# EAGLE design wearable_sensor_v2(public) (EAGLE 8.4.1)
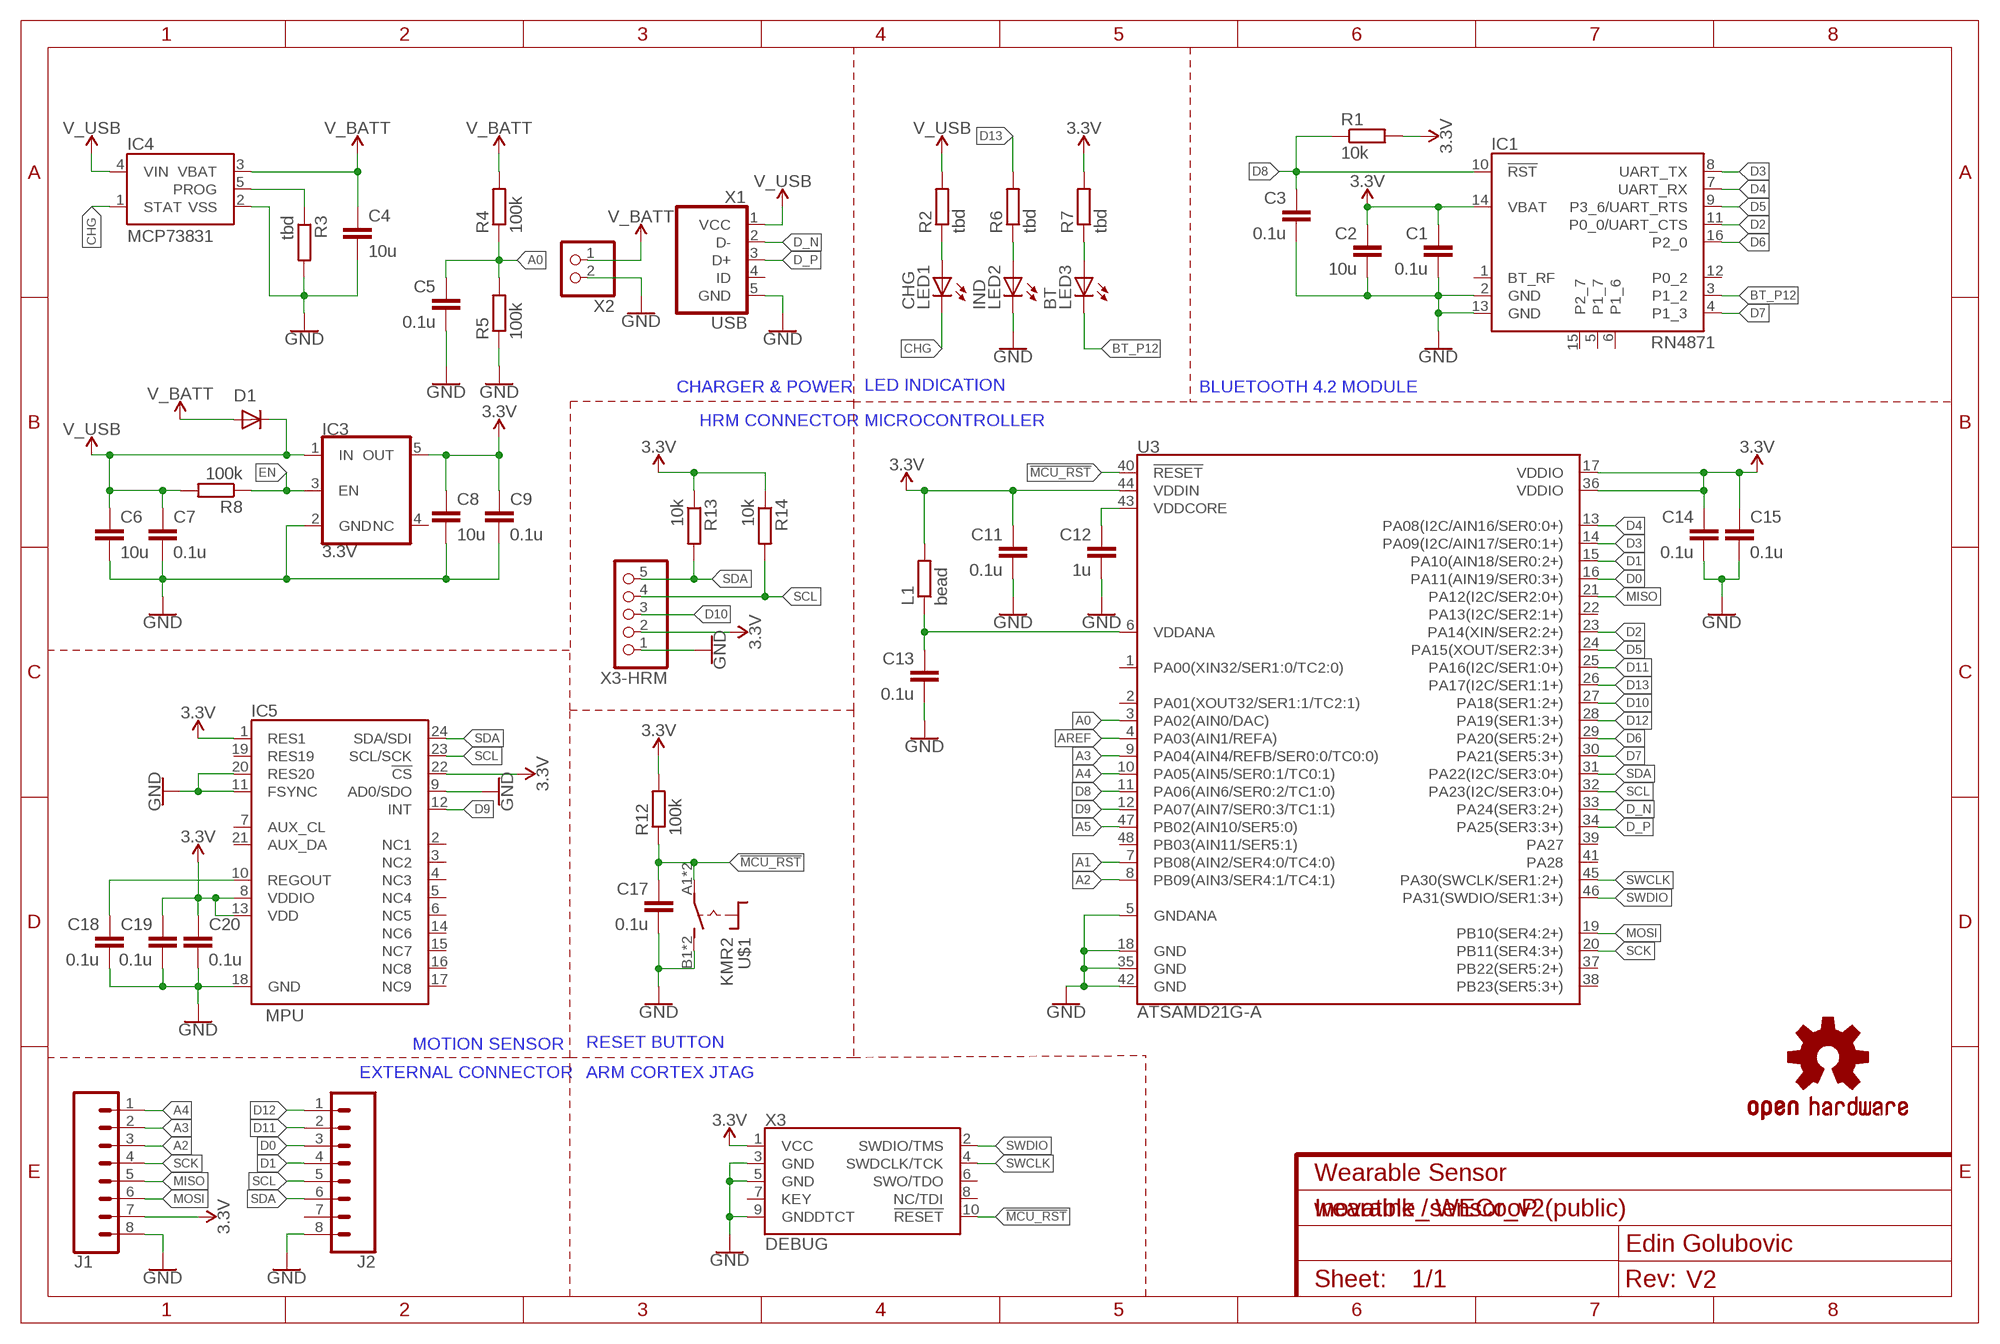
[diagram p0: schematic, sheet 1]
FRAME1 (FRAME-A4L): CNAME: Wearable Sensor; CREVISION: V2; DESIGNER: Edin Golubovic

## Parts
C1  0.1u  C-EUC0805  [C0805]
C2  10u  C-EUC0805  [C0805]
C3  0.1u  C-EUC0805  [C0805]
C4  10u  C-EUC0805  [C0805]
C5  0.1u  C-EUC0805  [C0805]
C6  10u  C-EUC0805  [C0805]
C7  0.1u  C-EUC0805  [C0805]
C8  10u  C-EUC0805  [C0805]
C9  0.1u  C-EUC0805  [C0805]
C11  0.1u  C-EUC0805  [C0805]
C12  1u  C-EUC0805  [C0805]
C13  0.1u  C-EUC0805  [C0805]
C14  0.1u  C-EUC0805  [C0805]
C15  0.1u  C-EUC0805  [C0805]
C17  0.1u  C-EUC0805  [C0805]
C18  0.1u  C-EUC0805  [C0805]
C19  0.1u  C-EUC0805  [C0805]
C20  0.1u  C-EUC0805  [C0805]
D1  DIODESOD-323F  [SOD-323F]
IC1  RN4871  [RN4871]
IC3  3.3V  V_REG_AP2112K-3.3V  [SOT23-5]
IC4  MCP73831  [SOT23-5]
IC5  MPU  MPU-9250  [MPU9250]
J1  CONN_08SMD-MALE  [1X08_SMD_MALE]
J2  CONN_08SMD-MALE  [1X08_SMD_MALE]
L1  bead  R-EU_R0805  [R0805]
LED1  CHG  LEDCHIP-LED0805  [CHIP-LED0805]
LED2  IND  LEDCHIP-LED0805  [CHIP-LED0805]
LED3  BT  LEDCHIP-LED0805  [CHIP-LED0805]
LOGO1  OSHW-LOGOMINI  [OSHW-LOGO-MINI]
R1  10k  R-EU_R0805  [R0805]
R2  tbd  R-EU_R0805  [R0805]
R3  tbd  R-EU_R0805  [R0805]
R4  100k  R-EU_R0805  [R0805]
R5  100k  R-EU_R0805  [R0805]
R6  tbd  R-EU_R0805  [R0805]
R7  tbd  R-EU_R0805  [R0805]
R8  100k  R-EU_R0805  [R0805]
R12  100k  R-EU_R0805  [R0805]
R13  10k  R-EU_R0805  [R0805]
R14  10k  R-EU_R0805  [R0805]
U3  ATSAMD21G-A  [TQFP-48]
U$1  KMR2  [KMR2]
X1  USB  10118194-0001LF  [10118194-0001LF]
X2  JST_2PIN-SMT-RA  [JST-PH-2-SMT-RA]
X3  DEBUG  CORTEX_DEBUG_PTH  [2X5-PTH-1.27MM]
X3-HRM  PINHD-1X5  [1X05]

## Nets
3.3V: C1.1 C2.1 C8.1 C9.1 C11.1 C14.1 C15.1 C19.1 C20.1 IC1.14(VBAT) IC3.5(OUT) IC5.1(RES1) IC5.8(VDDIO) IC5.13(VDD) IC5.22(!CS) J1.7 L1.2 R1.2 R7.2 R12.2 R13.1 R14.1 U3.17(VDDIO) U3.36(VDDIO) U3.44(VDDIN) X3-HRM.2 X3.1(VCC)
!MCU_RST: C17.1 R12.1 U3.40(!RESET!) U$1.A1(P) U$1.A2(P) X3.10(!RESET)
A0: C5.1 R4.1 R5.2 U3.3(PA02(AIN0/DAC))
A1: U3.7(PB08(AIN2/SER4:0/TC4:0))
A2: J1.3 U3.8(PB09(AIN3/SER4:1/TC4:1))
A3: J1.2 U3.9(PA04(AIN4/REFB/SER0:0/TC0:0))
A4: J1.1 U3.10(PA05(AIN5/SER0:1/TC0:1))
A5: U3.47(PB02(AIN10/SER5:0))
AREF: U3.4(PA03(AIN1/REFA))
BT_P12: IC1.3(P1_2) LED3.C
CHG: IC4.1(STAT) LED1.C
D0: J2.3 U3.16(PA11(AIN19/SER0:3+))
D1: J2.4 U3.15(PA10(AIN18/SER0:2+))
D2: IC1.11(P0_0/UART_CTS) U3.23(PA14(XIN/SER2:2+))
D3: IC1.8(UART_TX) U3.14(PA09(I2C/AIN17/SER0:1+))
D4: IC1.7(UART_RX) U3.13(PA08(I2C/AIN16/SER0:0+))
D5: IC1.9(P3_6/UART_RTS) U3.24(PA15(XOUT/SER2:3+))
D6: IC1.16(P2_0) U3.29(PA20(SER5:2+))
D7: IC1.4(P1_3) U3.30(PA21(SER5:3+))
D8: C3.1 IC1.10(!RST) R1.1 U3.11(PA06(AIN6/SER0:2/TC1:0))
D9: IC5.12(INT) U3.12(PA07(AIN7/SER0:3/TC1:1))
D10: U3.27(PA18(SER1:2+)) X3-HRM.3
D11: J2.2 U3.25(PA16(I2C/SER1:0+))
D12: J2.1 U3.28(PA19(SER1:3+))
D13: R6.2 U3.26(PA17(I2C/SER1:1+))
D_N: U3.33(PA24(SER3:2+)) X1.2(D-)
D_P: U3.34(PA25(SER3:3+)) X1.3(D+)
EN: IC3.3(EN) R8.1
GND: C1.2 C2.2 C3.2 C4.2 C5.2 C6.2 C7.2 C8.2 C9.2 C11.2 C12.2 C13.2 C14.2 C15.2 C17.2 C18.2 C19.2 C20.2 IC1.2(GND) IC1.13(GND) IC3.2(GND) IC4.2(VSS) IC5.9(AD0/SDO) IC5.11(FSYNC) IC5.18(GND) IC5.20(RES20) J1.8 J2.8 LED2.C R3.2 R5.1 U3.5(GNDANA) U3.18(GND) U3.35(GND) U3.42(GND) U$1.B1(S) U$1.B2(S) X1.5(GND) X2.2 X3-HRM.1 X3.3(GND) X3.5(GND) X3.9(GNDDTCT)
MISO: J1.5 U3.21(PA12(I2C/SER2:0+))
MOSI: J1.6 U3.19(PB10(SER4:2+))
N$1: LED2.A R6.1
N$2: LED1.A R2.1
N$3: IC4.5(PROG) R3.1
N$4: LED3.A R7.1
N$5: C18.1 IC5.10(REGOUT)
N$6: C13.1 L1.1 U3.6(VDDANA)
N$7: C12.1 U3.43(VDDCORE)
SCK: J1.4 U3.20(PB11(SER4:3+))
SCL: IC5.23(SCL/SCK) J2.5 R14.2 U3.32(PA23(I2C/SER3:0+)) X3-HRM.4
SDA: IC5.24(SDA/SDI) J2.6 R13.2 U3.31(PA22(I2C/SER3:0+)) X3-HRM.5
SWCLK: U3.45(PA30(SWCLK/SER1:2+)) X3.4(SWDCLK/TCK)
SWDIO: U3.46(PA31(SWDIO/SER1:3+)) X3.2(SWDIO/TMS)
V_BATT: C4.1 D1.A IC4.3(VBAT) R4.2 X2.1
V_USB: C6.1 C7.1 D1.C IC3.1(IN) IC4.4(VIN) R2.2 R8.2 X1.1(VCC)
Unconnected: IC1.1(BT_RF) IC1.5(P1_7) IC1.6(P1_6) IC1.12(P0_2) IC1.15(P2_7) IC3.4(NC) IC5.2(NC1) IC5.3(NC2) IC5.4(NC3) IC5.5(NC4) IC5.6(NC5) IC5.7(AUX_CL) IC5.14(NC6) IC5.15(NC7) IC5.16(NC8) IC5.17(NC9) IC5.19(RES19) IC5.21(AUX_DA) J2.7 U3.1(PA00(XIN32/SER1:0/TC2:0)) U3.2(PA01(XOUT32/SER1:1/TC2:1)) U3.22(PA13(I2C/SER2:1+)) U3.37(PB22(SER5:2+)) U3.38(PB23(SER5:3+)) U3.39(PA27) U3.41(PA28) U3.48(PB03(AIN11/SER5:1)) X1.4(ID) X3.6(SWO/TDO) X3.7(KEY) X3.8(NC/TDI)

## Notes on the sheet
- CHARGER & POWER | LED INDICATION | BLUETOOTH 4.2 MODULE
- HRM CONNECTOR | MICROCONTROLLER
- MOTION SENSOR | RESET BUTTON
- EXTERNAL CONNECTOR | ARM CORTEX JTAG
- Inovatink / WECooP

## Library data of the parts
C1-C9 C11-C15 C17-C20 = rcl:C-EU: CAPACITOR, European symbol
D1 = adafruit:DIODE: Diode SMADIODE - SMA Surface Mount Package 20V 1A Schottky Diode Digikey: 641-1014-6-ND DO-1N4148 - Through Hole Small Current Diode SOD-123 20V 1 A (.5mV Vf) Schottky Diode - Digikey: MBRX120TPMSCT-ND SOD-323 10V 570mA (.38mV Vf, 3ns) Schottky Diode - Digikey: ZLLS410CT-ND SOD-523 30V 30mA Schottky Diode (RB751S-40TE61) - Digikey: RB751S-40TE61CT-ND SOT23-R/W - SOT23 Package (R = Solder Paste/Reflow Ovens, W = Hand-Soldering) BAT54Film 40V 300mA - Digikey: 497-7162-1-ND
IC1 = private:RN4871
IC3 = SparkFun-IC-Power:V_REG_AP2112: AP2112 - 600mA CMOS LDO Regulator w/ Enable The AP2112 is CMOS process low dropout linear regulator with enable function, the regulator delivers a guaranteed 600mA (min.) continuous load current. Features Output Voltage Accuracy: ±1.5% Output Current: 600mA (Min.) Foldback Short Current Protection: 50mA Enable Function to Turn ON/OFF VOUT Low Dropout Voltage (3.3V): 250mV (Typ.) @IOUT=600mA Excellent Load Regulation: 0.2%/A (Typ.) Excellent Line Regulation: 0.02%/V (Typ.) Low Quiescent Current: 55μA (Typ.) Low Standby Current: 0.01μA (Typ.) Low Output Noise: 50μVRMS PSRR: 100Hz -65dB, 1kHz -65dB OTSD Protection Stable with 1.0μF Flexible Cap: Ceramic, Tantalum and Aluminum Electrolytic Operation Temperature Range: -40°C to 85°C ESD: MM 400V, HBM 4000V; PROD_ID: VREG-12457
IC4 = SparkFun-IC-Power:MCP73831: MCP73831T Li-Ion, Li-Pol Controller Miniature single cell, fully integrated Li-Ion, Li-polymer charge management controller Datasheet <http://ww1.microchip.com/downloads/en/DeviceDoc/20001984g.pdf> SparkFun Products: SparkFun ESP32 Thing <https://www.sparkfun.com/products/13907> SparkFun 9DoF Razor IMU M0 <https://www.sparkfun.com/products/14001>; PROD_ID: IC-09995
IC5 = private:MPU-9250: MPU-9250 is a 9-axis MotionTracking device that combines a 3-axis gyroscope, 3-axis accelerometer, 3-axis magnetometer and a Digital Motion Processor™ (DMP)
J1 J2 = SparkFun-Connectors:CONN_08: Multi connection point. Often used as Generic Header-pin footprint for 0.1 inch spaced/style header connections On any of the 0.1 inch spaced packages, you can populate with these: Break Away Headers - Straight <https://www.sparkfun.com/products/116> (PRT-00116) Break Away Male Headers - Right Angle <https://www.sparkfun.com/products/553> (PRT-00553) Female Headers <https://www.sparkfun.com/products/115> (PRT-00115) Break Away Headers - Machine Pin <https://www.sparkfun.com/products/117> (PRT-00117) Break Away Female Headers - Swiss Machine Pin <https://www.sparkfun.com/products/743> (PRT-00743) Arduino Stackable Header - 8 Pin <https://www.sparkfun.com/products/9279> (PRT-09279) For SCREWTERMINALS and SPRING TERMINALS visit here: Screw Terimnals on SparkFun.com <https://www.sparkfun.com/search/results?term=Screw+Terminals> (5mm/3.5mm/2.54mm spacing) This device is also useful as a general connection point to wire up your design to another part of your project. Our various solder wires solder well into these plated through hole pads. Hook-Up Wire - Assortment (Stranded, 22 AWG) <https://www.sparkfun.com/products/11375> (PRT-11375) Hook-Up Wire - Assortment (Solid Core, 22 AWG) <https://www.sparkfun.com/products/11367> (PRT-11367) View the entire wire category on our website here <https://www.sparkfun.com/categories/141> Special notes: Molex polarized connector foot print use with SKU : PRT-08231 with associated crimp pins and housings. 1MM SMD Version SKU: PRT-10208 NOTES ON THE VARIANTS LOCK and LOCK_LONGPADS... This footprint was designed to help hold the alignment of a through-hole component (i.e. 6-pin header) while soldering it into place. You may notice that each hole has been shifted either up or down by 0.005 of an inch from it's more standard position (which is a perfectly straight line). This slight alteration caused the pins (the squares in the middle) to touch the edges of the holes. Because they are alternating, it causes a "brace" to hold the component in place. 0.005 has proven to be the perfect amount of "off-center" position when using our standard breakaway headers. Although looks a little odd when you look at the bare footprint, once you have a header in there, the alteration is very hard to notice. Also,if you push a header all the way into place, it is covered up entirely on the bottom side.; PROD_ID: CONN-11292; SF_ID: PRT-11541
L1 R1-R8 R12-R14 = rcl:R-EU_: RESISTOR, European symbol
LED1-LED3 = led:LED: LED OSRAM: - CHIPLED LG R971, LG N971, LY N971, LG Q971, LY Q971, LO R971, LY R971 LH N974, LH R974 LS Q976, LO Q976, LY Q976 LO Q996 - Hyper CHIPLED LW Q18S LB Q993, LB Q99A, LB R99A - SideLED LS A670, LO A670, LY A670, LG A670, LP A670 LB A673, LV A673, LT A673, LW A673 LH A674 LY A675 LS A676, LA A676, LO A676, LY A676, LW A676 LS A679, LY A679, LG A679 - Hyper Micro SIDELED® LS Y876, LA Y876, LO Y876, LY Y876 LT Y87S - SmartLED LW L88C, LW L88S LB L89C, LB L89S, LG L890 LS L89K, LO L89K, LY L89K LS L896, LA L896, LO L896, LY L896 - TOPLED LS T670, LO T670, LY T670, LG T670, LP T670 LSG T670, LSP T670, LSY T670, LOP T670, LYG T670 LG T671, LOG T671, LSG T671 LB T673, LV T673, LT T673, LW T673 LH T674 LS T676, LA T676, LO T676, LY T676, LB T676, LH T676, LSB T676, LW T676 LB T67C, LV T67C, LT T67C, LS T67K, LO T67K, LY T67K, LW E67C LS E67B, LA E67B, LO E67B, LY E67B, LB E67C, LV E67C, LT E67C LW T67C LS T679, LY T679, LG T679 LS T770, LO T770, LY T770, LG T770, LP T770 LB T773, LV T773, LT T773, LW T773 LH T774 LS E675, LA E675, LY E675, LS T675 LS T776, LA T776, LO T776, LY T776, LB T776 LHGB T686 LT T68C, LB T68C - Hyper Mini TOPLED® LB M676 - Mini TOPLED Santana® LG M470 LS M47K, LO M47K, LY M47K Source: http://www.osram.convergy.de LUXEON: - LUMILED® LXK2-PW12-R00, LXK2-PW12-S00, LXK2-PW14-U00, LXK2-PW14-V00 LXK2-PM12-R00, LXK2-PM12-S00, LXK2-PM14-U00 LXK2-PE12-Q00, LXK2-PE12-R00, LXK2-PE12-S00, LXK2-PE14-T00, LXK2-PE14-U00 LXK2-PB12-K00, LXK2-PB12-L00, LXK2-PB12-M00, LXK2-PB14-N00, LXK2-PB14-P00, LXK2-PB14-Q00 LXK2-PR12-L00, LXK2-PR12-M00, LXK2-PR14-Q00, LXK2-PR14-R00 LXK2-PD12-Q00, LXK2-PD12-R00, LXK2-PD12-S00 LXK2-PH12-R00, LXK2-PH12-S00 LXK2-PL12-P00, LXK2-PL12-Q00, LXK2-PL12-R00 Source: www.luxeon.com KINGBRIGHT: KA-3528ASYC Source: www.kingbright.com
LOGO1 = SparkFun-Aesthetics:OSHW-LOGO: Open-Source Hardware (OSHW) Logo This logo indicates the piece of hardware it is found on incorporates a OSHW license and/or adheres to the definition of open source hardware found here: http://freedomdefined.org/OSHW
U3 = SparkFun-IC-Microcontroller:ATSAMD21G: Atmel SAMD21G SMART ARM-Based Microcontroller The Atmel ® | SMART ™ SAM D21 is a series of low-power microcontrollers using the 32-bit ARM ® Cortex ® -M0+ processor, and ranging from 32- to 64-pins with up to 256KB Flash and 32KB of SRAM. The SAM D21 devices operate at a maximum frequency of 48MHz and reach 2.46 CoreMark/MHz. They are designed for simple and intuitive migration with identical peripheral modules, hex compatible code, identical linear address map and pin compatible migration paths between all devices in the product series. All devices include intelligent and flexible peripherals, Atmel Event System for inter-peripheral signaling, and support for capacitive touch button, slider and wheel user interfaces. Datasheet <https://cdn.sparkfun.com/datasheets/Dev/Arduino/Boards/Atmel-42181-SAM-D21_Datasheet.pdf> SparkFun Products SparkFun SAMD21 Mini Breakout <https://www.sparkfun.com/products/13664> (DEV-13664) SparkFun SAMD21 Dev Breakout <https://www.sparkfun.com/products/13672> (DEV-13672); PROD_ID: IC-13064
U$1 = private:KMR2
X1 = con-fci:10118194-0001LF
X2 = adafruit:JST_2PIN: JST 2-Pin Connectors of various flavors SMT-RA (S2B-PH-SM4) 4UConnector #17311 SMT (B2B-PH-SM4) THM-RA (S2B-PH) THM (B2B-PH)
X3 = SparkFun-Connectors:CORTEX_DEBUG: Cortex Debug Connector - 10 pin Supports JTAG debug, Serial Wire debug, and Serial Wire Viewer. PTH and SMD connector options available. General Connector Information <http://infocenter.arm.com/help/topic/com.arm.doc.faqs/attached/13634/cortex_debug_connectors.pdf> Products: PTH Connector <http://www.digikey.com/product-detail/en/cnc-tech/3220-10-0100-00/1175-1627-ND/3883661> -via Digi-Key SparkFun PSoc <https://www.sparkfun.com/products/13229> SparkFun T <https://www.sparkfun.com/products/13810>
X3-HRM = pinhead:PINHD-1X5: PIN HEADER

## Board
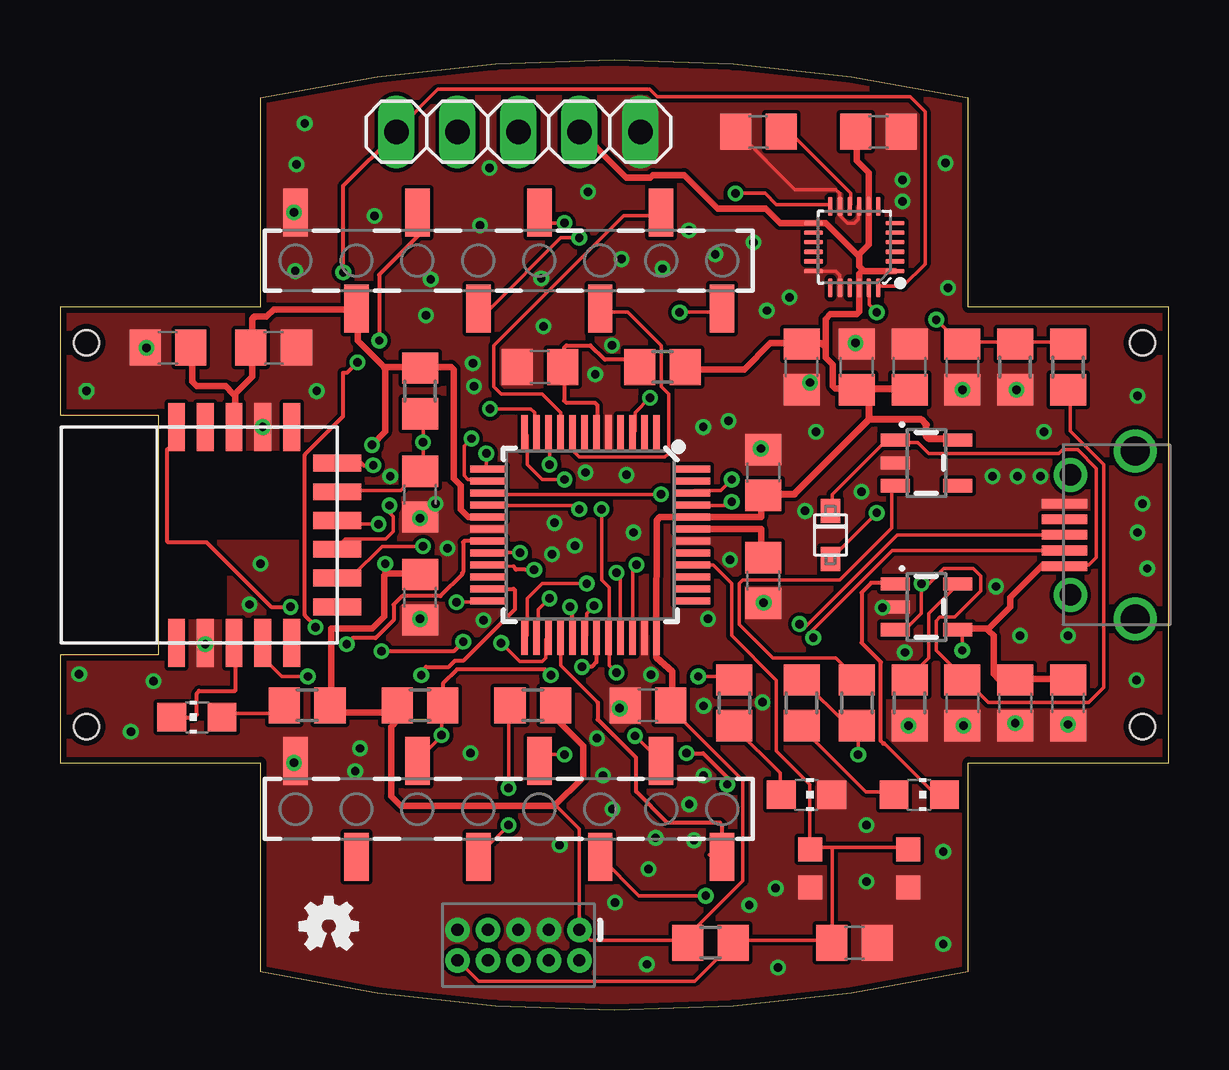
[diagram p1: board, top side]
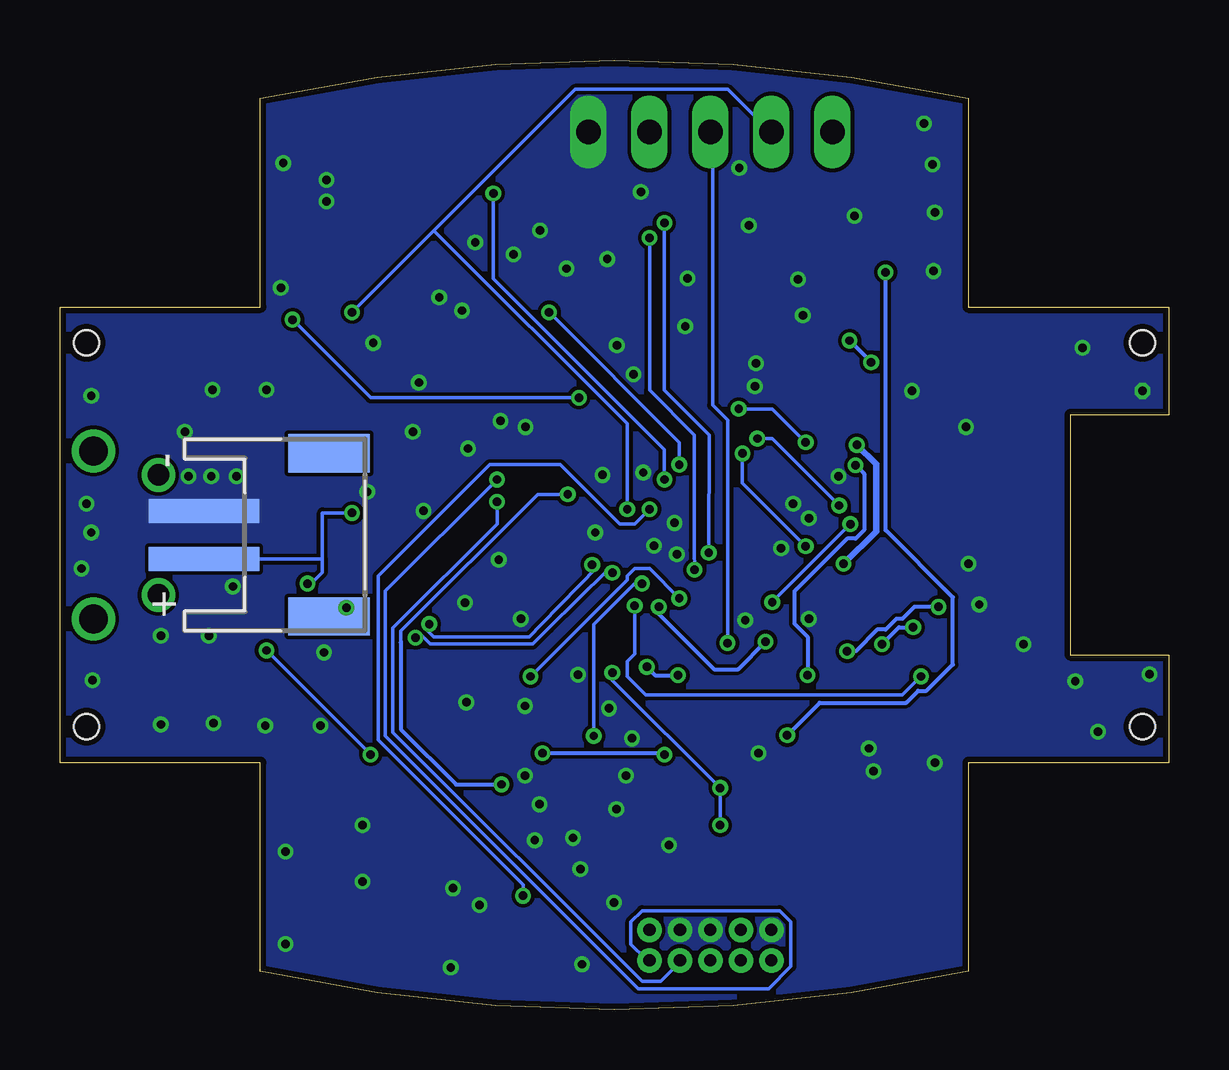
[diagram p2: board, bottom side, seen from below]

Size 46.2 x 39.6 mm. Coordinates in mm from the lower left corner, seen from the top.
Outline: 8.35,1.6 arc25 37.85,1.6 37.85,10.3 46.2,10.3 46.2,29.3 37.85,29.3 37.85,38 arc25 8.35,38 8.35,29.3 0,29.3 0,24.8 4.1,24.8 4.1,14.8 0,14.8 0,10.3 8.35,10.3 8.35,1.6
Copper layers (1*16): Top 0.035mm / dielectric 1.5mm / Bottom 0.035mm
Design rules "SeeedStudio_2layer_DRU_no_angle_20140221": minimum track width 6mil, minimum drill 12mil, track to track 6mil, track to pad 6mil, pad to pad 6mil, via to via 6mil, smd to smd 0mil, copper to edge 10mil, drill to drill 10mil, minimum pad ring 10mil, minimum via ring 6mil, stop-mask expansion 2mil, vias tented up to drill 100mil, thermal gap 10mil
Holes 1.05 mm at 1.1,27.8 1.1,11.8 45.1,27.8 45.1,11.8

### Footprints (pad centres in the part's own frame; a part is rotated, then mirrored left to right if it is on the bottom)
C0805 = smd 1.3 x 1.5: 1 -0.95,0; 2 0.95,0
SOD-323F = smd 1 x 0.8: A -1,0; C 1,0
RN4871 = smd 2 x 0.7: 1 -4.5,0.95; 2 -4.5,-0.25; 3 -4.5,-1.45; 4 -4.5,-2.65; 5 -4.5,-3.85; 12 4.5,-3.85; 13 4.5,-2.65; 14 4.5,-1.45; 15 4.5,-0.25; 16 4.5,0.95 | smd 0.7 x 2: 6 -3,-5.75; 7 -1.8,-5.75; 8 -0.6,-5.75; 9 0.6,-5.75; 10 1.8,-5.75; 11 3,-5.75
SOT23-5 = smd 0.55 x 1.2: 1 -0.95,-1.3; 2 0,-1.3; 3 0.95,-1.3; 4 0.95,1.3; 5 -0.95,1.3
MPU9250 = smd 0.8 x 0.2: 1 -1.7,1; 2 -1.7,0.6; 3 -1.7,0.2; 4 -1.7,-0.2; 5 -1.7,-0.6; 6 -1.7,-1; 13 1.7,-1; 14 1.7,-0.6; 15 1.7,-0.2; 16 1.7,0.2; 17 1.7,0.6; 18 1.7,1 | smd 0.2 x 0.8: 7 -1,-1.7; 8 -0.6,-1.7; 9 -0.2,-1.7; 10 0.2,-1.7; 11 0.6,-1.7; 12 1,-1.7; 19 1,1.7; 20 0.6,1.7; 21 0.2,1.7; 22 -0.2,1.7; 23 -0.6,1.7; 24 -1,1.7
1X08_SMD_MALE = smd 1.02 x 2: 1 -8.89,2; 2 -6.35,-2; 3 -3.81,2; 4 -1.27,-2; 5 1.27,2; 6 3.81,-2; 7 6.35,2; 8 8.89,-2
R0805 = smd 1.3 x 1.5: 1 -0.95,0; 2 0.95,0
CHIP-LED0805 = smd 1.2 x 1.2: A 0,-1.05; C 0,1.05
TQFP-48 = smd 1.5 x 0.28: 1 -4.25,2.75; 2 -4.25,2.25; 3 -4.25,1.75; 4 -4.25,1.25; 5 -4.25,0.75; 6 -4.25,0.25; 7 -4.25,-0.25; 8 -4.25,-0.75; 9 -4.25,-1.25; 10 -4.25,-1.75; 11 -4.25,-2.25; 12 -4.25,-2.75; 25 4.25,-2.75; 26 4.25,-2.25; 27 4.25,-1.75; 28 4.25,-1.25; 29 4.25,-0.75; 30 4.25,-0.25; 31 4.25,0.25; 32 4.25,0.75; 33 4.25,1.25; 34 4.25,1.75; 35 4.25,2.25; 36 4.25,2.75 | smd 0.28 x 1.5: 13 -2.75,-4.25; 14 -2.25,-4.25; 15 -1.75,-4.25; 16 -1.25,-4.25; 17 -0.75,-4.25; 18 -0.25,-4.25; 19 0.25,-4.25; 20 0.75,-4.25; 21 1.25,-4.25; 22 1.75,-4.25; 23 2.25,-4.25; 24 2.75,-4.25; 37 2.75,4.25; 38 2.25,4.25; 39 1.75,4.25; 40 1.25,4.25; 41 0.75,4.25; 42 0.25,4.25; 43 -0.25,4.25; 44 -0.75,4.25; 45 -1.25,4.25; 46 -1.75,4.25; 47 -2.25,4.25; 48 -2.75,4.25
KMR2 = smd 1 x 1: A1 -2.05,0.8; A2 2.05,0.8; B1 -2.05,-0.8; B2 2.05,-0.8
10118194-0001LF = smd 0.4 x 1.9: 1 -1.3,2.95; 2 -0.65,2.95; 3 0,2.95; 4 0.65,2.95; 5 1.3,2.95 | drill 0.9 pad 1.3: P$6 2.5,2.7; P$7 -2.5,2.7 | drill 1.2 pad 1.6: P$8 3.5,0; P$9 -3.5,0
JST-PH-2-SMT-RA = smd 1 x 4.6: 1 1,-3.7; 2 -1,-3.7 | smd 1.6 x 3.4: NC1 -3.4,1.5; NC2 3.4,1.5
2X5-PTH-1.27MM = drill 0.508 pad 1: 1 -2.54,-0.635; 2 -2.54,0.635; 3 -1.27,-0.635; 4 -1.27,0.635; 5 0,-0.635; 6 0,0.635; 7 1.27,-0.635; 8 1.27,0.635; 9 2.54,-0.635; 10 2.54,0.635
1X05 = drill 1.016 long: 1 -5.08,0; 2 -2.54,0; 3 0,0; 4 2.54,0; 5 5.08,0

### Placement (x,y rotation side)
C1  4.5,27.6 180 top
C2  8.9,27.6 0 top
C3  15,21.5 270 top
C4  37.6,12.8 270 top
C5  37.6,26.8 270 top
C6  42,12.8 270 top
C7  39.8,12.8 270 top
C8  35.4,26.8 90 top
C9  33.2,26.8 90 top
C11  29.3,22.4 90 top
C12  29.3,17.9 270 top
C13  20,26.8 180 top
C14  24.5,12.7 180 top
C15  15,17.2 270 top
C17  33.1,2.8 0 top
C18  29.1,36.6 180 top
C19  34.1,36.6 0 top
C20  30.9,26.8 270 top
D1  32.1,19.8 90 top
IC1  5.8,19.8 90 top
IC3  36.1,22.8 270 top
IC4  36.1,16.8 270 top
IC5  33.1,31.8 180 top
J1  18.7,31.23 180 top
J2  18.7,8.37 180 top
L1  25.1,26.8 0 top
LED1  35.8,8.97 270 top
LED2  31.1,8.97 270 top
LED3  5.7,12.2 90 top
LOGO1  11.2,3.5 0 top
R1  15,25.8 90 top
R2  30.9,12.8 90 top
R3  35.4,12.8 270 top
R4  42,26.8 270 top
R5  39.8,26.8 90 top
R6  28.1,12.8 90 top
R7  10.3,12.7 0 top
R8  33.2,12.8 270 top
R12  27.1,2.8 180 top
R13  15,12.7 0 top
R14  19.7,12.7 180 top
U3  22.1,19.8 270 top
U$1  33.3,5.9 0 top
X1  44.8,19.8 90 top
X2  36.5,19.8 270 bottom
X3  19.1,2.7 180 top
X3-HRM  19.1,36.6 180 top

### Tracks (layer width: path | path; a pad name or v marks a point on that pad's centre or on a via)
3.3V  (via drill 0.35)
  Top 0.155: 20.6,8.5 20.71,8.48 21.64,7.55 21.64,3.36 X3.1 21.79,3.21 22.1,2.9 26.13,2.9 R12.2 26.29,2.9 26.29,3.21 28.45,5.38 28.45,9.56 25.51,12.5 C14.1
  Top 0.28: C11.1 29.2,21.4 29.21,20.55 U3.44 24.99,20.55 24.86,20.41 24.85,15.64 U3.36 24.85,14.7 25.5,14.1 25.5,12.7 C14.1 25.5,12.6 | R14.1 20.7,12.7 20.7,12.1 21.8,11 21.8,9.7 20.6,8.5 14.2,8.5 13.8,8.9 13.8,11.8 14.1,12.1 14.1,12.7 R13.1 | R13.1 14,12.4 11.3,12.4 11.3,12.7 R7.2 11.3,12.8 11.3,15.9 13,15.9 13.5,16.4 13.5,18.1 13.6,18.2 | 14.1,12.8 R13.1 | 15.1,18.2 C15.1 14.9,18.2 13.6,18.2 | 31.9,27.6 31.7,27.8 30.9,27.8 C20.1 30.8,27.8 29.6,27.8 28.5,26.7 26.1,26.7 26,26.8 L1.2 | 31.9,27.6 31.9,27.2 32.2,26.9 32.2,26 32.3,25.9 33.1,25.9 C9.1 | 7.3,25.7 8,26.4 8,27.6 C2.1 8,27.7 8,28.8 8.1,28.9 8.6,28.9 8.9,29.2 12.3,29.2 J1.7 12.4,29.1 12.4,27.9 13.5,26.8 | 7.3,25.7 7.3,24.3 IC1.14 | C1.1 5.5,27.6 5.5,26.2 5.7,26 6.9,26 7.2,25.7 7.3,25.7 | 13.5,26.8 15,26.8 R1.2 15.1,26.8 16.3,26.8 16.4,26.7 16.4,22.15 16.7,21.85 16.7,20.85 17,20.55 U3.17 | X3-HRM.2 21.7,36.6 23.6,34.7 24.6,34.7 24.7,34.8 26,34.8 27.4,33.4 29.4,33.4 30,32.8 IC5.13 31.9,32.8 33.2,31.5 33.3,31.5 | IC5.1 33.4,30.8 | 33.4,30.8 33.3,30.7 IC5.22 33.3,29.1 33.2,29 32.1,29 31.9,28.8 31.9,27.6 | 33.3,31.5 33.7,31.9 IC5.8 33.7,34.9 33.2,35.4 33.2,36.6 C19.1 | 33.3,31.5 33.3,31 33.4,30.9 33.4,30.8 | v13,23.55 13.55,24.1 13.55,26.7 13.5,26.8 | v13.55,18.6 13.55,18.3 13.6,18.2
  Top 0.3: 33.7,24.6 30.6,21.5 29.3,21.5 C11.1 | 33.7,24.6 35.9,24.6 36.1,24.4 36.1,23.9 36.2,23.8 37.4,23.8 IC3.5 | 33.7,24.6 33.7,25.9 33.2,25.9 C9.1 33.8,25.9 35.4,25.9 C8.1
  Bottom 0.28: v13,23.55 12.2,22.75 12.2,19.95 v13.55,18.6
!MCU_RST
  Top 0.155: X3.10 16.68,1.97 17.45,1.19 26.44,1.19 27.99,2.74 R12.1 28.14,2.9 32.02,2.9 C17.1 32.17,2.9 32.17,6.77 | 32.17,6.77 35.27,6.77 U$1.A2 | 32.17,6.77 31.4,6.77 U$1.A1 31.24,6.77 31.24,9.41 29.85,10.8 29.85,13.74 27.99,15.6 27.99,17.77 27.21,18.55 26.44,18.55 U3.40
A0  (via drill 0.35)
  Top 0.155: R4.1 41.93,27.84 39.92,27.84 R5.2 39.77,27.84 37.75,27.84 C5.1 37.6,27.69 v36.51,28.77 | v24.58,25.52 23.96,24.9 23.96,24.13 U3.3
  Bottom 0.155: v24.58,25.52 33.26,25.52 v36.51,28.77
A2
  Top 0.155: U3.8 21.33,23.97 21.33,23.35 21.64,23.04 25.2,23.04 25.36,23.2 25.36,25.67 25.05,25.98 25.05,27.69 23.65,29.08 22.57,29.08 J1.3
A3
  Top 0.155: U3.9 20.86,24.13 20.86,24.9 20.09,25.67 18.38,25.67 18.07,25.98 18.07,27.69 23.5,33.11 25.05,33.11 J1.2
A4  (via drill 0.35)
  Top 0.155: v20.4,22.73 20.4,23.97 U3.10 | v25.82,29.08 27.52,29.08 J1.1
  Bottom 0.155: v20.4,22.73 20.4,23.66 v25.82,29.08
BT_P12
  Top 0.155: 7.23,14.67 7.23,15.29 IC1.3
  Top 0.16: IC1.3 7.3,14.7 7.3,13.3 5.8,13.3 5.7,13.2 5.7,12.3 5.6,12.2 LED3.C
CHG
  Top 0.155: 34.34,17.62 34.65,17.62 IC4.1 | 34.34,11.11 36.36,9.1 36.82,9.1 LED1.C
  Top 0.16: IC4.1 34.7,17.8 33.8,17.8 33.4,17.4 33.4,15.3 34.2,14.5 34.2,11.2 34.3,11.1 34.34,11.11
D0  (via drill 0.35)
  Top 0.155: v21.64,20.87 21.48,21.03 17.92,21.03 U3.16 | v26.91,4.76 24.12,4.76 22.57,6.31 J2.3
  Bottom 0.155: v21.64,20.87 22.26,20.25 22.88,20.25 25.36,22.73 28.3,22.73 32.95,18.08 32.95,11.27 26.91,5.22 v26.91,4.76
D1  (via drill 0.35)
  Top 0.155: v25.05,21.49 17.92,21.49 U3.15 | v21.02,10.65 20.24,10.65 20.09,10.49 J2.4
  Top 0.16: v26.1,10.7 26.8,10.7 27.8,9.7 v27.8,9.4 27.8,9.3
  Bottom 0.155: v25.05,21.49 26.29,21.49 32,15.8 32,15.34 32,15.3
  Bottom 0.16: v26.1,10.7 21.1,10.7 v21.02,10.65 | v27.8,9.4 29.7,9.4 32,11.7 32,15.3 32,15.34
D2  (via drill 0.35)
  Top 0.16: 15.05,14.1 v15.05,13.95 15.1,14.15 15.25,14.3 16.2,14.3 16.45,14.55 16.8,14.55 18.95,16.7 18.95,17.5 18.9,17.55 U3.23 | v13.05,22.7 12.65,22.7 12.55,22.8 IC1.11
  Bottom 0.16: v15.05,13.95 15.05,15.55 15.6,16.1 15.6,17.45 13.4,19.65 13.05,19.65 12.7,20 12.7,22.35 v13.05,22.7
D3  (via drill 0.35)
  Top 0.155: v17.14,23.82 16.83,23.51 16.83,22.27 16.99,22.11 17.76,22.11 U3.14 | v13.73,21.03 13.73,20.72 13.89,20.56 13.89,19.94 13.58,19.63 11.88,19.63 11.57,19.32 IC1.8
  Bottom 0.155: v17.14,23.82 16.52,23.82 v13.73,21.03
D4  (via drill 0.35)
  Top 0.155: v17.76,23.2 17.76,22.58 U3.13 | v15.13,19.32 13.42,19.32 12.19,18.08 11.57,18.08 IC1.7
  Bottom 0.155: v17.76,23.2 17.76,21.96 v15.13,19.32
D5  (via drill 0.35)
  Top 0.155: v16.52,17 17.76,17 U3.24 | v13.27,20.25 11.57,20.25 IC1.9
  Bottom 0.155: v13.27,20.25 v16.52,17
D6  (via drill 0.35)
  Top 0.16: v9.6,16.8 8.8,16.8 6.1,19.5 4.5,19.5 4.45,19.55 4.45,23.35 4.5,23.4 4.8,23.4 4.85,23.45 IC1.16 | v13.4,14.95 16.4,14.95 v16.8,15.35 | v21.25,16.8 21.25,16.7 21.35,16.6 U3.29
  Bottom 0.16: v13.4,14.95 13.05,14.95 12.15,15.85 11.8,15.85 11.35,16.3 11.1,16.3 10.6,16.8 v9.6,16.8 | v16.8,15.35 17.95,14.2 18.95,14.2 21.25,16.5 v21.25,16.8
D7  (via drill 0.35)
  Top 0.155: v22.26,16.84 21.95,16.53 21.95,15.6 U3.30 | v10.33,13.9 9.24,13.9 8.47,14.67 8.47,15.29 IC1.4
  Bottom 0.155: v22.26,16.84 22.26,14.83 22.57,14.52 22.57,13.9 21.79,13.12 11.1,13.12 v10.33,13.9
D8  (via drill 0.35)
  Top 0.155: R1.1 15.13,24.74 v15.13,23.66 15.13,22.58 C3.1 14.97,22.42 14.2,21.65 11.57,21.65 IC1.10 | v17.92,25.05 19.62,25.05 19.78,24.9 19.78,24.13 U3.11
  Bottom 0.155: v17.92,25.05 16.52,25.05 v15.13,23.66
D9  (via drill 0.35)
  Top 0.155: v28.14,34.04 29.38,34.04 29.85,33.58 32.02,33.58 IC5.12 | v21.02,22.11 20.09,22.11 19.47,22.73 19.47,23.97 U3.12
  Bottom 0.155: v28.14,34.04 28.14,30.48 21.02,23.35 v21.02,22.11
D10  (via drill 0.35)
  Top 0.155: v18.38,15.29 19.16,14.52 20.09,14.52 20.24,14.67 20.24,15.45 U3.27
  Bottom 0.155: v18.38,15.29 18.38,24.59 19,25.21 19,36.52 X3-HRM.3
D11  (via drill 0.35)
  Top 0.155: v21.95,17.77 20.09,17.77 19.47,17.15 19.47,15.6 U3.25 | v23.96,11.42 25.05,10.34 J2.2
  Bottom 0.155: v21.95,17.77 22.26,17.77 23.96,16.07 v23.96,11.42
D12
  Top 0.155: 22.41,12.81 20.86,14.36 20.86,15.45 U3.28 | 27.06,6.46 27.52,6.46 J2.1
  Top 0.16: 22.41,12.81 22.4,12.8 22.4,12.1 24,10.5 24,9.1 25.3,7.8 27.5,7.8 27.6,7.7 27.6,6.4 J2.1
D13  (via drill 0.35)
  Top 0.155: v20.4,17.15 19.93,16.69 19.93,15.6 U3.26 | v26.6,13.9 27.99,13.9 R6.2
  Bottom 0.155: v20.4,17.15 21.64,18.39 22.26,18.39 22.57,18.08 22.57,17.93 v26.6,13.9
D_N  (via drill 0.35)
  Top 0.155: X1.2 34.67,19.15 31.21,15.69 v31.39,15.51 | v23.19,18.22 23.27,18.27 23.35,18.34 23.35,17.13 23.35,15.6 | 23.35,15.6 23.35,15.4 | U3.33 23.34,15.6 23.35,15.6
  Bottom 0.155: v31.39,15.51 31.21,15.69 30.76,15.24 26.51,15.24 25.83,15.92 23.4,18.33 v23.19,18.22
D_P  (via drill 0.35)
  Top 0.155: X1.3 34.88,19.8 30.99,15.91 v30.81,16.09 | v24.03,18.56 23.86,18.36 23.86,15.35 U3.34
  Bottom 0.155: v30.81,16.09 30.99,15.91 30.64,15.55 26.66,15.55 26.16,16.06 23.8,18.47 v24.03,18.56
EN
  Top 0.155: IC3.3 34.65,21.8 34.65,20.1 32.48,17.93 28.45,17.93 28.3,17.77 28.3,16.07 29.69,14.67 32.33,14.67 33.1,13.9 R8.1
GND  (via drill 0.35)
  Top 0.155: IC5.20 32.48,30.17 32.48,30.63 32.33,30.79 31.55,30.79 IC5.18 | IC5.9 33.26,33.42 33.26,32.96 33.1,32.8 32.79,32.8 32.48,33.11 32.48,33.42 IC5.11 32.48,33.58 32.48,34.04 32.33,34.2 30.62,34.2 28.3,36.52 C18.2
  other vias: 1.1,25.8 23.6,22.3 26.8,24.3 31.5,24.1 15,20.5 3.6,27.6 7.9,16.9 17.1,10.7 10.7,25.8 23.9,19.9 27,16.3 45.1,21.1 45.3,18.4 40,15.6 42,15.6 33.4,21.6 12.5,10.9 15,16.3 13.76,22.24 41,24.1 44.9,25.6 37,30.1 36.9,35.3 35.1,34.6 35.1,33.7 30.4,29.7 28.9,32 26.2,32.5 27.3,31.5 25.1,30.9 23.4,31.3 17.5,32.7 17.9,35.1 35.2,14.9 34.27,16.77 29.32,16.97 24.62,13.97 26.82,12.67 26.82,9.77 26.22,8.57 23.32,12.57 22.37,11.32 26.42,7.07 24.82,7.17 24.52,5.87 23.02,8.37 22.62,9.77 23.12,4.47 20.82,6.87 27.92,18.77 21.9,22.4 23,27.7 22.3,26.5 29.27,12.82 29.82,5.07 28.72,4.37 29.92,1.77 3.9,13.7 9.8,30.8 10.2,36.95 9.85,35.25 22,34.1 15.45,30.45 27.85,24.55 17.65,16.25 20.6,20.3 21.45,19.35 20.5,19 40.85,22.25 39.9,22.25 38.85,22.25 16.15,19.25 15.65,21.1 8.35,18.6 0.8,14 2.95,11.6 12.3,9.95 24.45,1.9 33.6,5.35 36.8,2.75 36.8,6.6 33.6,7.7 44.85,13.75 42,11.9 39.8,11.95 37.65,11.85 20.05,30.5 35.35,11.85 39,17.65 44.9,19.9 31.05,20.8 29.2,23.4 31.25,26.15 37.6,25.85 39.85,25.85 33.15,27.8 29.45,29.15 20.15,28.5 17.2,26.95 9.75,33.25 13.1,33.1 15.25,28.95 8.45,24.3 6.05,15.25 9.75,10.3 17.25,26
  pour Top (no thermals): 0.1,-0.2 46.1,-0.2 46.1,39.8 0.1,39.8
  pour Bottom (no thermals): 0.1,-0.2 46.1,-0.2 46.1,39.8 0.1,39.8
MISO  (via drill 0.35)
  Top 0.155: v19.76,18.35 19.4,18.35 | 18.9,18.49 | 18.9,18.49 17.92,18.5 U3.21 | v21.64,32.18 20.86,32.18 17.92,29.24 17.45,29.24 J1.5
  Top 0.16: 18.9,18.49 18.9,18.5 18.99,18.35 19.39,18.35 19.4,18.35
  Bottom 0.155: v19.76,18.35 19.78,19.17 19.78,23.97 21.64,25.83 v21.64,32.18
MOSI  (via drill 0.35)
  Top 0.16: v12.4,27 11.95,26.55 11.8,26.55 11.8,24.75 10.2,23.15 10.2,16.45 10.65,16 v10.65,15.95 | v13.3,27.9 13.3,30.65 14.9,32.25 14.9,33.2 J1.6 | v11.95,15.25 12.2,15.5 13.15,15.5 13.9,16.25 13.9,16.9 14.25,17.25 15.85,17.25 16.75,18.15 16.75,18.2 16.8,18.25 16.8,19.5 16.85,19.55 U3.19
  Bottom 0.16: v13.3,27.9 v12.4,27 | v10.65,15.95 11.25,15.95 v11.95,15.25
N$1
  Top 0.155: LED2.A 30,9.1 30,9.87 28.14,11.73 R6.1
N$2
  Top 0.155: LED1.A 34.65,9.1 33.57,9.1 30.93,11.73 R2.1
N$3
  Top 0.155: IC4.5 37.29,17.62 36.2,16.53 36.2,14.67 35.43,13.9 R3.1
N$4
  Top 0.155: LED3.A 6.76,12.35 8.93,12.35 9.24,12.66 R7.1
N$5
  Top 0.155: IC5.10 32.95,33.58 32.95,34.04 30.47,36.52 30.16,36.52 C18.1
N$6
  Top 0.155: 21.02,26.91 C13.1 | 24.12,26.91 L1.1 | 22.41,24.13 U3.6
  Top 0.16: U3.6 22.4,24.2 22.4,25.2 22.3,25.3 21.1,25.3 21,25.4 21,26.8 C13.1 21,26.9 21,27.6 21.1,27.7 22.1,27.7 22.7,27.1 24.2,27.1 24.2,26.9 L1.1
N$7
  Top 0.28: U3.43 29.21,20.05 29.22,19.85 29.21,18.99 29.2,18.9 29.3,18.8 C12.1
SCK  (via drill 0.35)
  Top 0.155: v19.17,19.06 18.59,19.07 17.82,19.07 U3.20 | v21.02,32.8 20.4,32.8 20.09,33.11 J1.4
  Bottom 0.155: v19.17,19.06 19.16,23.97 21.02,25.83 v21.02,32.8
SCL  (via drill 0.35)
  Top 0.155: v18.69,9.25 18.69,12.66 R14.2 | v18.69,7.7 17.45,6.46 J2.5 | v23.19,14.05 22.88,14.36 22.88,15.45 U3.32 22.88,15.6 22.88,17.62 22.57,17.93 v22.57,20.87 | v34.03,29.08 33.72,29.39 33.72,30.01 IC5.23
  Bottom 0.155: v18.69,7.7 v18.69,9.25 23.19,13.74 v23.19,14.05 | 30.62,32.49 24.74,38.38 18.38,38.38 16.68,36.68 X3-HRM.4 | 30.62,32.49 v34.03,29.08 | v22.57,20.87 22.57,24.44 30.62,32.49
SDA  (via drill 0.35)
  Top 0.155: R13.2 15.9,12.66 15.9,11.42 14.97,10.49 J2.6 | IC5.24 34.19,30.17 35.12,30.17 36.05,31.1 36.05,37.45 35.43,38.07 24.89,38.07 24.58,38.38 15.75,38.38 14.04,36.68 X3-HRM.5
  Top 0.16: R13.2 15.95,13.6 16.55,14.2 20.2,14.2 v20.45,13.95 | v21.75,14.3 22.15,14.3 22.35,14.5 U3.31 | v11.8,30.75 11.8,34.35 14,36.55 X3-HRM.5 | v15.9,11.45 15.9,11.42
  Bottom 0.16: v20.45,13.95 21.4,13.95 v21.75,14.3 | v11.8,30.75 11.8,20 9,17.2 9,14.4 10.1,13.3 10.45,13.3 10.95,12.8 14.55,12.8 v15.9,11.45
SWCLK  (via drill 0.35)
  Top 0.155: v27.99,21.18 27.83,21.03 26.44,21.03 U3.45
  Bottom 0.155: v27.99,21.18 27.99,20.25 32.33,15.91 32.33,11.57 21.95,1.19 21.17,1.19 20.4,1.97 X3.4
SWDIO  (via drill 0.35)
  Top 0.155: v27.99,22.11 27.52,21.65 26.44,21.65 U3.46
  Bottom 0.155: v27.99,22.11 32.64,17.46 32.64,11.42 22.1,0.88 16.68,0.88 15.75,1.81 15.75,3.67 16.21,4.14 21.95,4.14 22.41,3.67 22.41,2.74 21.79,2.12 X3.2
V_BATT  (via drill 0.35)
  Top 0.155: v34.03,20.72 32.17,18.86 D1.A | 36.05,17.62 36.82,18.39 38.06,18.39 38.37,18.08 38.37,17.46 37.29,16.38 36.67,16.38 36.51,16.22 36.51,14.98 37.6,13.9 C4.1 37.75,13.74 38.68,12.81 42.86,12.81 43.48,13.43 43.48,22.73 42.09,24.13 42.09,25.83 R4.2 | 36.05,17.62 35.89,17.46 35.89,16.53 35.27,15.91 34.81,15.91 IC4.3 | 36.05,17.62 v35.89,17.77
  Bottom 0.152: X2.1 35.27,18.8
  Bottom 0.155: v34.03,20.72 35.27,20.72 35.27,18.8 35.27,18.24 35.74,17.77 v35.89,17.77
V_USB  (via drill 0.35)
  Top 0.155: D1.C 32.17,20.87 32.17,21.49 34.34,23.66 34.65,23.66 IC3.1 34.81,23.66 35.74,23.66 36.2,23.2 41.62,23.2 41.78,23.35 42.4,23.35 43.17,22.58 43.17,18.86 42.86,18.55 41.93,18.55 X1.1 | R2.2 30.93,13.74 32.79,11.88 33.1,11.88 R8.2 33.26,11.73 v33.26,10.65 | v37.6,14.98 37.6,15.91 IC4.4
  Top 0.28: 38.7,15.9 39.6,16.8 39.6,17.2 40.9,18.5 X1.1 | 38.7,15.9 37.5,15.9 IC4.4 | 38.7,15.9 38.7,15.8 38.9,15.6 38.9,14 39.1,13.8 39.8,13.8 C7.1 39.9,13.8 42,13.8 C6.1
  Bottom 0.155: v37.6,14.98 v33.26,10.65